# Altium schematic sheet Filter_Main2.SchDoc
size A2; SheetNumber: 1; SheetTotal: 2
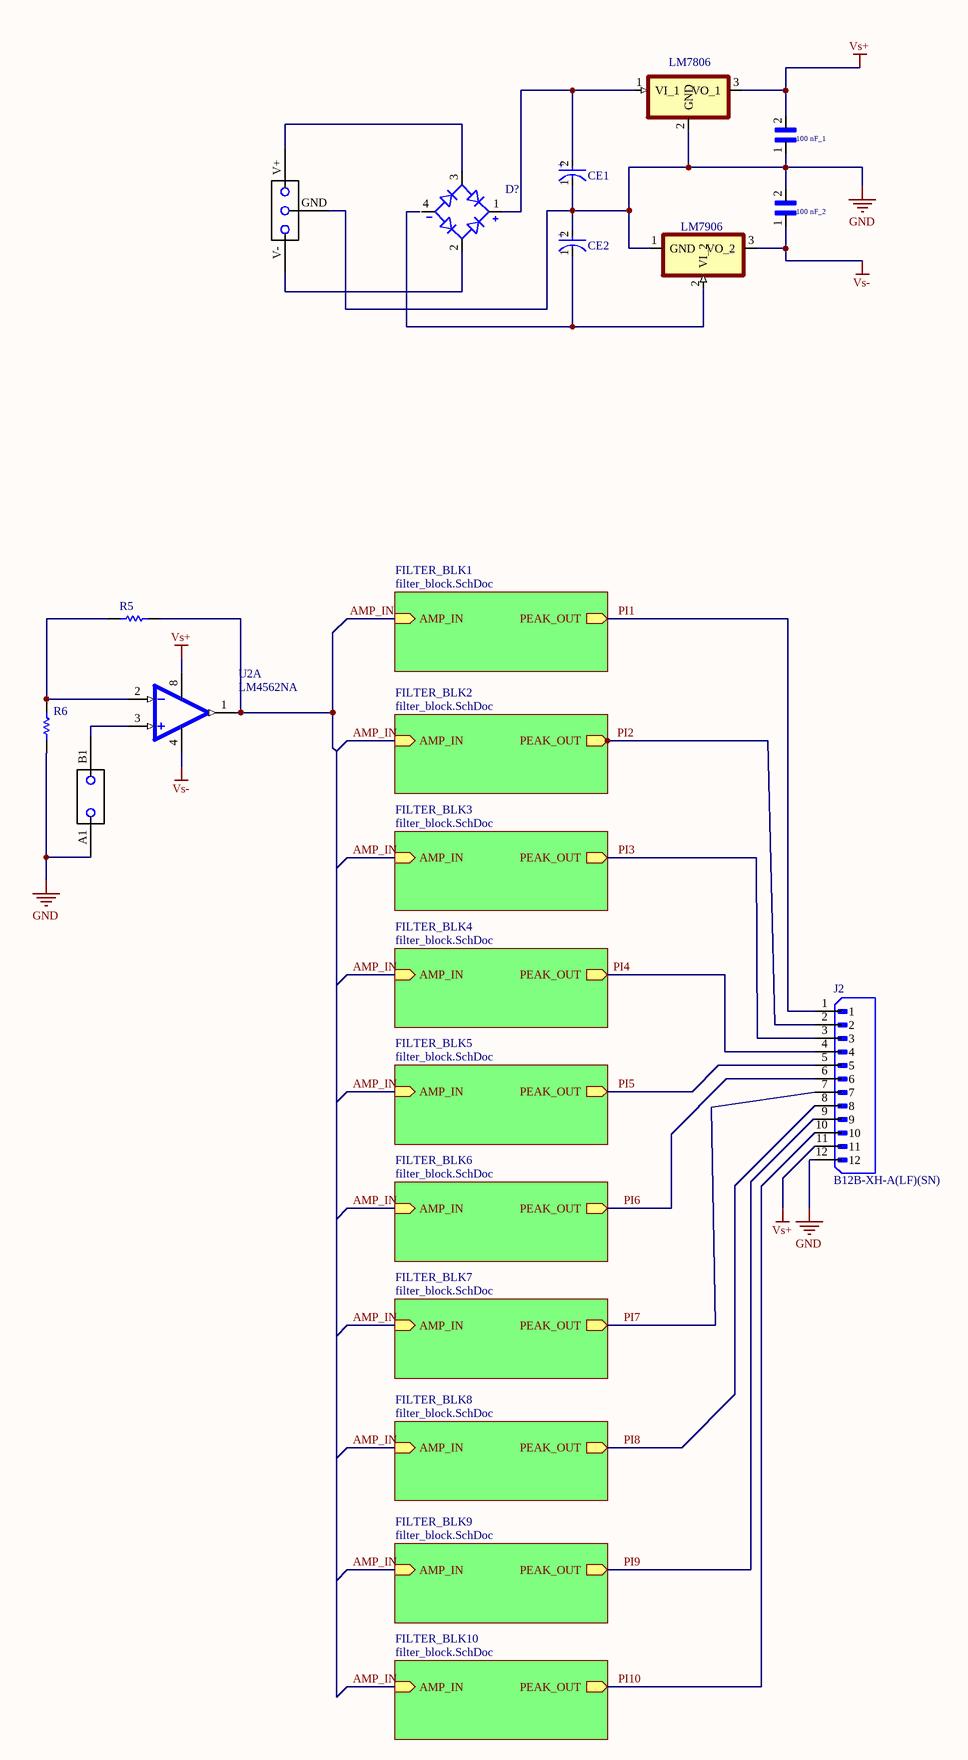
[diagram p0: Filter_Main2.SchDoc]

## Parts
100_nF_1  100 nF  [100 nF]  (value not drawn)
100_nF_2  100 nF  [100 nF]  (value not drawn)
*  transformer_output  [transformer_output]  (value not drawn)
CE1  1000 uF  [1000 uF]  (value not drawn)
CE2  1000 uF  [1000 uF]  (value not drawn)
D?  rectifier_bridge  [rectifier_bridge]  (value not drawn)
J2  B12B-XH-A(LF)(SN)  [JST_B12B-XH-A(LF)(SN)]
LM7806  LM7806  [LM7806]  (value not drawn)
LM7906  LM7906  [LM7906]  (value not drawn)
P  Input_Output_Pin_Custom  [Input_Output_Pin_Custom]  (value not drawn)
R5  MFR-25FBF5210K  [RESA60-630X240]  (value not drawn)
R6  MFR-25FBF5210K  [RESA60-630X240]  (value not drawn)
U2  LM4562NA  [DIP794W45P254L959H508Q8]  (part A of 2)

## Sub-sheets
FILTER_BLK1 = filter_block.SchDoc: AMP_IN (in), PEAK_OUT (out)
FILTER_BLK2 = filter_block.SchDoc: AMP_IN (in), PEAK_OUT (out)
FILTER_BLK3 = filter_block.SchDoc: AMP_IN (in), PEAK_OUT (out)
FILTER_BLK4 = filter_block.SchDoc: AMP_IN (in), PEAK_OUT (out)
FILTER_BLK5 = filter_block.SchDoc: AMP_IN (in), PEAK_OUT (out)
FILTER_BLK6 = filter_block.SchDoc: AMP_IN (in), PEAK_OUT (out)
FILTER_BLK7 = filter_block.SchDoc: AMP_IN (in), PEAK_OUT (out)
FILTER_BLK8 = filter_block.SchDoc: AMP_IN (in), PEAK_OUT (out)
FILTER_BLK9 = filter_block.SchDoc: AMP_IN (in), PEAK_OUT (out)
FILTER_BLK10 = filter_block.SchDoc: AMP_IN (in), PEAK_OUT (out)

## Nets
GND: 100_nF_1.1 100_nF_2.2 *.GND CE1.1(C) CE2.2(A) J2.12 LM7806.2(GND) LM7906.1(GND) P.A1 R6.1
Vs+: 100_nF_1.2 J2.11 LM7806.3(VO_1) U2.8(V+)
Vs-: 100_nF_2.1 LM7906.3(VO_2) U2.4(V-)
AMP_IN: R5.2 U2.1(OUTA) ; sheet FILTER_BLK1/AMP_IN, sheet FILTER_BLK2/AMP_IN, sheet FILTER_BLK3/AMP_IN, sheet FILTER_BLK4/AMP_IN, sheet FILTER_BLK5/AMP_IN, sheet FILTER_BLK6/AMP_IN, sheet FILTER_BLK7/AMP_IN, sheet FILTER_BLK8/AMP_IN, sheet FILTER_BLK9/AMP_IN, sheet FILTER_BLK10/AMP_IN
PI1: J2.1 ; sheet FILTER_BLK1/PEAK_OUT
PI2: J2.2 ; sheet FILTER_BLK2/PEAK_OUT
PI3: J2.3 ; sheet FILTER_BLK3/PEAK_OUT
PI4: J2.4 ; sheet FILTER_BLK4/PEAK_OUT
PI5: J2.5 ; sheet FILTER_BLK5/PEAK_OUT
PI6: J2.6 ; sheet FILTER_BLK6/PEAK_OUT
PI7: J2.7 ; sheet FILTER_BLK7/PEAK_OUT
PI8: J2.8 ; sheet FILTER_BLK8/PEAK_OUT
PI9: J2.9 ; sheet FILTER_BLK9/PEAK_OUT
PI10: J2.10 ; sheet FILTER_BLK10/PEAK_OUT
Net*_V+: *.V+ D?.3(AC2)
Net*_V-: *.V- D?.2(AC1)
NetCE1_2: CE1.2(A) D?.1(POS) LM7806.1(VI_1)
NetCE2_1: CE2.1(C) LM7906.2(VI_2)
NetP_B1: P.B1 U2.3(INA+)
NetR5_1: R5.1 R6.2 U2.2(INA-)

Not connected (* = marked no-connect by the designer): D? 4(NEG)

## Notes on the sheet
- (in symbol 1000 uF) +

## Library data of the parts
J2 = B12B-XH-A(LF)(SN): Connector Header Through Hole 12 position 0.098 (2.50mm); MF: JST Sales; SnapEDA_Link: https://www.snapeda.com/parts/B12B-XH-A(LF)(SN)/JST+Sales+America+Inc./view-part/?ref=snap; Package: None; Value: *; MP: B12B-XH-A(LF)(SN); Check_prices: https://www.snapeda.com/parts/B12B-XH-A(LF)(SN)/JST+Sales+America+Inc./view-part/?ref=eda
R5 R6 = CMP-1659-00074-2: Axial Resistor, 10 KOhm, +/- 1%, 0.25 W, -55 to 155 degC, 2-Pin THD, RoHS, Bulk; Manufacturer: Yageo; Temperature Coefficient: 100ppm\/degreesC; Voltage Rating: 250V; Voltage Rating (DC): 200V; Resistance: 10KOhm; Max Power Dissipation: 250mW; Datasheet URL: http://www.yageo.com/documents/recent/Yageo%20LR_MFR_2013.pdf; Packaging: Bulk; RoHSCompliant: True; Mount: ThroughHole; Package Reference: MFR-25; Termination: Axial; Composition: MetalFilm; Number of Terminations: 2; Package Quantity: 200; Mounting Technology: ThroughHole; Length: 0.248inch; Max Operating Temperature: 155degC; Min Operating Temperature: -55degC; Datasheet Version: 04/2013; Lead Free: LeadFree; Manufacturer URL: http://www.yageo.com/; Tolerance: 1%; Power Rating: 250mW; Package Description: 2-Pin Axial Lead, Dia 2.4 mm, Body Length 6.3 mm; Military Standard: Not; Case\/Package: Axial
U2 = LM4562NA: LM4562 2 - Dual Channels per IC Audio Amplifier Evaluation Board; MF: Texas Instruments; SnapEDA_Link: https://www.snapeda.com/parts/LM4562NA/Texas+Instruments/view-part/?ref=snap; Package: DIP-8 Texas Instruments; Value: *; MP: LM4562NA; Check_prices: https://www.snapeda.com/parts/LM4562NA/Texas+Instruments/view-part/?ref=eda